# EAGLE schematic HPG_Solution (EAGLE 9.6.2)

## Sheet 1 of 2
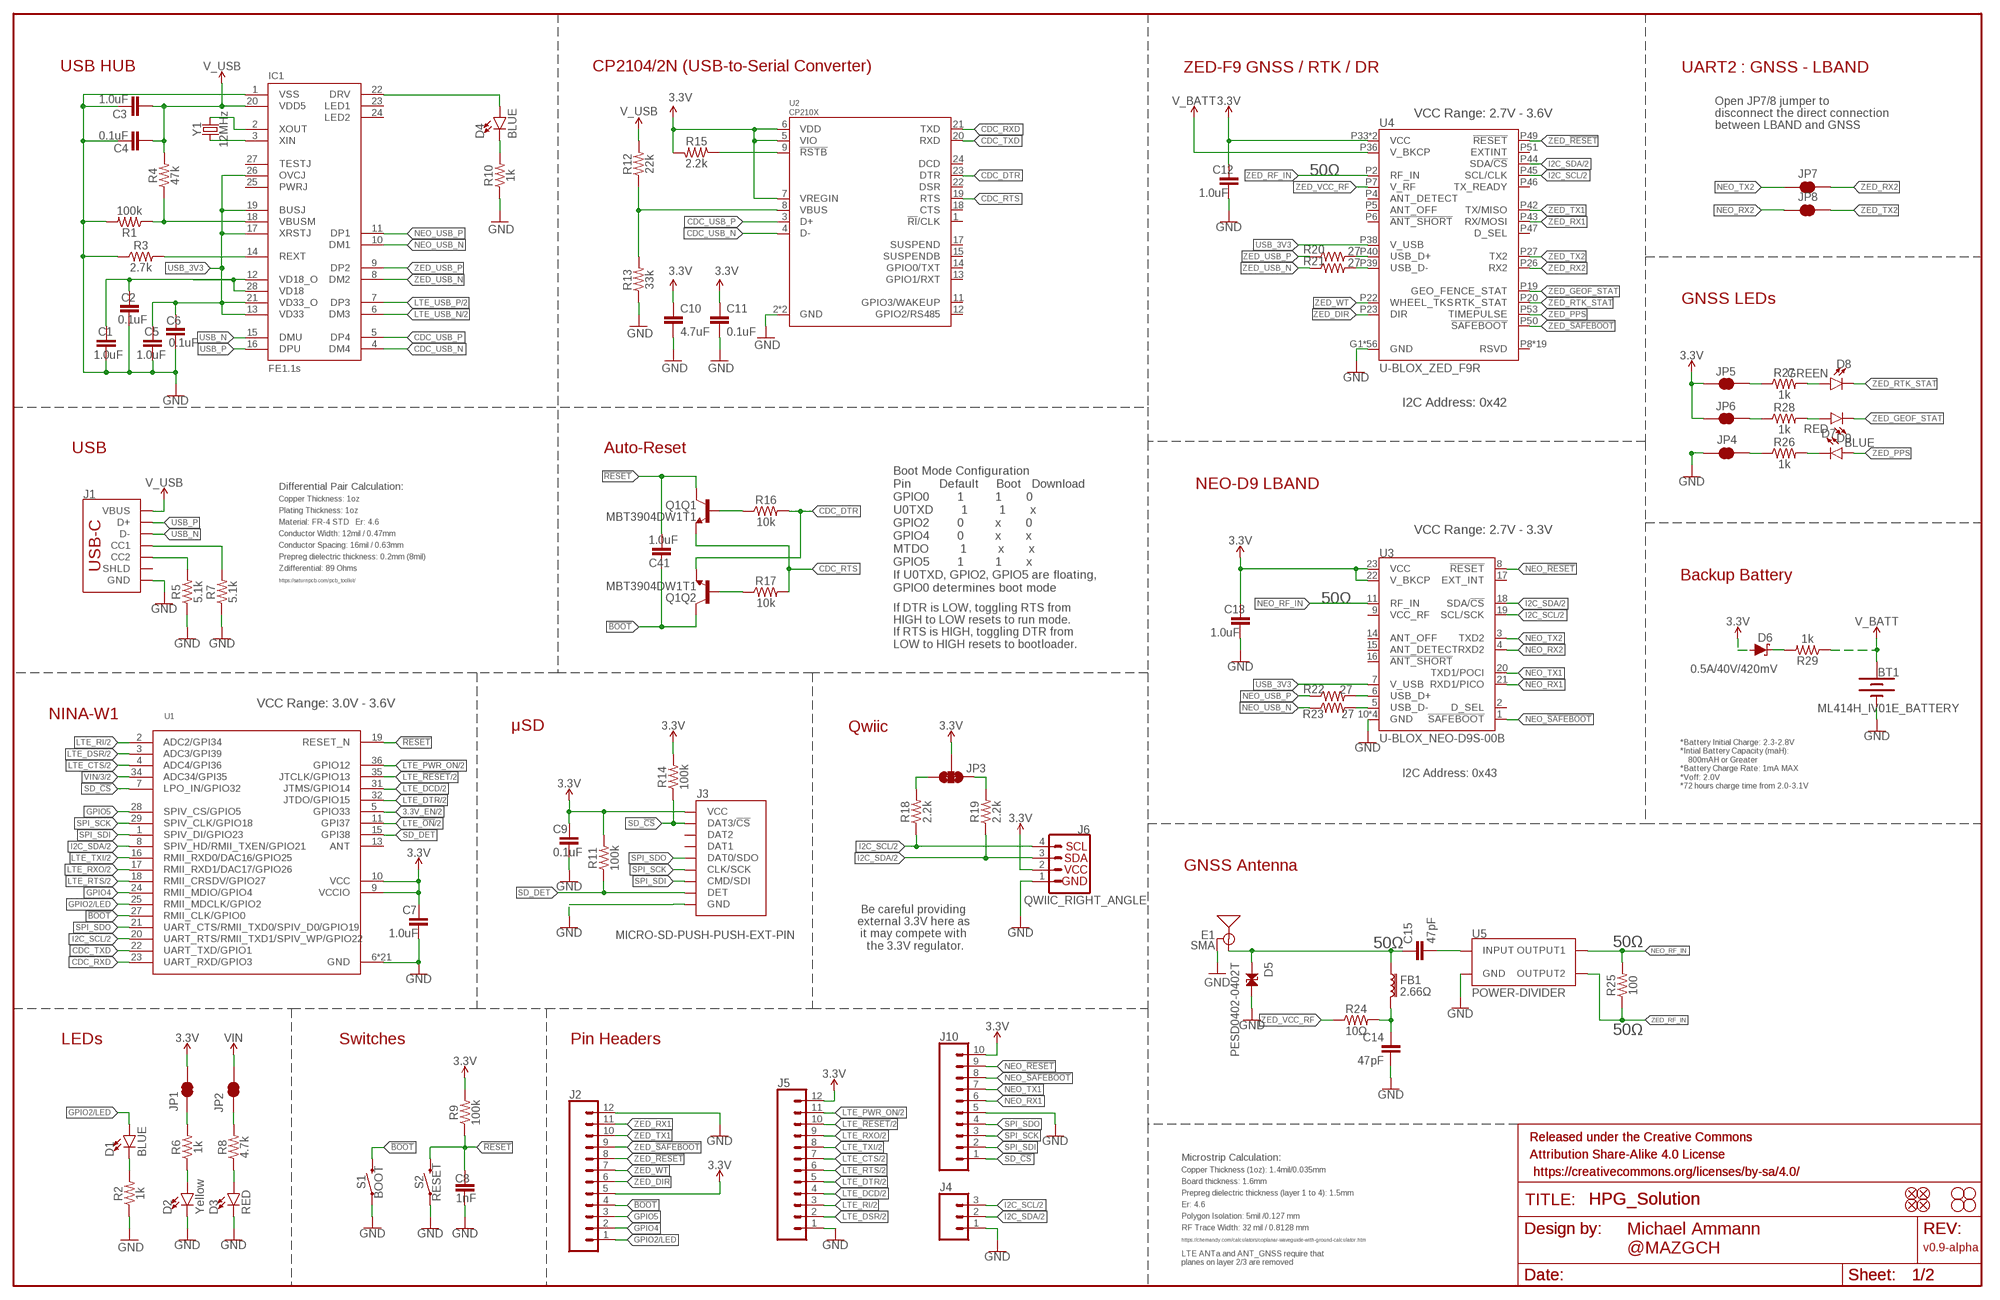
[diagram p0: schematic, sheet 1]

### Parts
BT1  ML414H_IV01E_BATTERY  [ML414H_IV01E]
C1  1.0uF  1.0UF-0603-16V-10%  [0603]
C2  0.1uF  0.1UF-0603-25V-5%  [0603]
C3  1.0uF  1.0UF-0603-16V-10%  [0603]
C4  0.1uF  0.1UF-0603-25V-5%  [0603]
C5  1.0uF  1.0UF-0603-16V-10%  [0603]
C6  0.1uF  0.1UF-0603-25V-5%  [0603]
C7  1.0uF  1.0UF-0603-16V-10%  [0603]
C8  1nF  1.0NF/1000PF-0603-50V-10%  [0603]
C9  0.1uF  0.1UF-0603-25V-5%  [0603]
C10  4.7uF  4.7UF0603  [0603]
C11  0.1uF  0.1UF-0603-25V-5%  [0603]
C12  1.0uF  1.0UF-0603-16V-10%  [0603]
C13  1.0uF  1.0UF-0603-16V-10%  [0603]
C14  47pF  47PF-0603-50V-5%  [0603]
C15  47pF  47PF-0603-50V-5%  [0603]
C41  1.0uF  1.0UF-0603-16V-10%  [0603]
D1  BLUE  LED-BLUE0603  [LED-0603]
D2  Yellow  LED-YELLOW0603  [LED-0603]
D3  RED  LED-RED0603  [LED-0603]
D4  BLUE  LED-BLUE0603  [LED-0603]
D5  PESD0402-0402T  [0402-TIGHT]
D6  0.5A/40V/420mV  DIODE-SCHOTTKY-PMEG4005EJ  [SOD-323]
D7  BLUE  LED-BLUE0603  [LED-0603]
D8  GREEN  LED-GREEN0603  [LED-0603]
D9  RED  LED-RED0603  [LED-0603]
E1  SMA  ANTENNA-SMA-GROUNDEDEDGE_SMA  [SMA-EDGE]
FB1  2.66Ω  FERRITE_BEAD-0402-2.66Ω-1GHZ  [0402-TIGHT]
FD1  FIDUCIALUFIDUCIAL  [FIDUCIAL-MICRO]
FD2  FIDUCIALUFIDUCIAL  [FIDUCIAL-MICRO]
FD3  FIDUCIALUFIDUCIAL  [FIDUCIAL-MICRO]
FD4  FIDUCIALUFIDUCIAL  [FIDUCIAL-MICRO]
FRAME1  FRAME-LEDGER  [CREATIVE_COMMONS]
FRAME2  FRAME-LEDGER  [CREATIVE_COMMONS]
H1  STAND-OFFTIGHT  [STAND-OFF-TIGHT]
H2  STAND-OFFTIGHT  [STAND-OFF-TIGHT]
H3  STAND-OFFTIGHT  [STAND-OFF-TIGHT]
H4  STAND-OFFTIGHT  [STAND-OFF-TIGHT]
IC1  FE1.1S  [FE1.1S_SSOP-28]
J1  USB_C_4-LAYER_PADS  [USB-C-16P_4LAYER-PADS]
J2  CONN_12NO_SILK  [1X12_NO_SILK]
J3  MICRO-SD-PUSH-PUSH-EXT-PIN  [MICROSD-EXTERNALPIN]
J4  CONN_031X03_NO_SILK  [1X03_NO_SILK]
J5  CONN_12NO_SILK  [1X12_NO_SILK]
J6  QWIIC_RIGHT_ANGLE  QWIIC_CONNECTORJS-1MM  [JST04_1MM_RA]
J10  CONN_10NO_SILK_PTH_FEMALE  [1X10_NO_SILK]
JP1  JUMPER-SMT_2_NC_TRACE_SILK  [SMT-JUMPER_2_NC_TRACE_SILK]
JP2  JUMPER-SMT_2_NC_TRACE_SILK  [SMT-JUMPER_2_NC_TRACE_SILK]
JP3  JUMPER-SMT_3_2-NC_TRACE_SILK  [SMT-JUMPER_3_2-NC_TRACE_SILK]
JP4  JUMPER-SMT_2_NC_TRACE_SILK  [SMT-JUMPER_2_NC_TRACE_SILK]
JP5  JUMPER-SMT_2_NC_TRACE_SILK  [SMT-JUMPER_2_NC_TRACE_SILK]
JP6  JUMPER-SMT_2_NC_TRACE_SILK  [SMT-JUMPER_2_NC_TRACE_SILK]
JP7  JUMPER-SMT_2_NC_TRACE_SILK  [SMT-JUMPER_2_NC_TRACE_SILK]
JP8  JUMPER-SMT_2_NC_TRACE_SILK  [SMT-JUMPER_2_NC_TRACE_SILK]
Q1  MBT3904DW1T1  TRANS_NPN_DUAL-MBT3904DW1T1  [SC70-6]
R1  100k  100KOHM-0603-1/10W-1%  [0603]
R2  1k  1KOHM-0603-1/10W-1%  [0603]
R3  2.7k  2.7KOHM-0603-1/10W-1%  [0603]
R4  47k  47KOHM-0603-1/10W-1%  [0603]
R5  5.1k  5.1KOHM5.1KOHM-0603-1/10W-1%  [0603]
R6  1k  1KOHM-0603-1/10W-1%  [0603]
R7  5.1k  5.1KOHM5.1KOHM-0603-1/10W-1%  [0603]
R8  4.7k  4.7KOHM-0603-1/10W-1%  [0603]
R9  100k  100KOHM-0603-1/10W-1%  [0603]
R10  1k  1KOHM-0603-1/10W-1%  [0603]
R11  100k  100KOHM-0603-1/10W-1%  [0603]
R12  22k  22KOHM-0603-1/10W-1%  [0603]
R13  33k  33KOHM-0603-1/10W-1%  [0603]
R14  100k  100KOHM-0603-1/10W-1%  [0603]
R15  2.2k  2.2KOHM-0603-1/10W-1%  [0603]
R16  10k  10KOHM-0603-1/10W-1%  [0603]
R17  10k  10KOHM-0603-1/10W-1%  [0603]
R18  2.2k  2.2KOHM-0603-1/10W-1%  [0603]
R19  2.2k  2.2KOHM-0603-1/10W-1%  [0603]
R20  27  27OHM-0603-1/10W-1%  [0603]
R21  27  27OHM-0603-1/10W-1%  [0603]
R22  27  27OHM-0603-1/10W-1%  [0603]
R23  27  27OHM-0603-1/10W-1%  [0603]
R24  10Ω  10OHM-0402-1/16W-5%  [0402-TIGHT]
R25  100  100OHM-0603-1/10W-1%  [0603]
R26  1k  1KOHM-0603-1/10W-1%  [0603]
R27  1k  1KOHM-0603-1/10W-1%  [0603]
R28  1k  1KOHM-0603-1/10W-1%  [0603]
R29  1k  1KOHM-0603-1/10W-1%  [0603]
S1  BOOT  MOMENTARY-SWITCH-SPST-SMD-5.2-TALL-REDUNDANT  [TACTILE_SWITCH_SMD_5.2MM]
S2  RESET  MOMENTARY-SWITCH-SPST-SMD-5.2-TALL-REDUNDANT  [TACTILE_SWITCH_SMD_5.2MM]
U1  NINA-W106NINA-W106  [NINA-W106]
U2  CP210X  CP2102N  [QFN24]
U3  U-BLOX_NEO-D9S-00B  [NEO-M9N/M8T/M8U/D9S]
U4  U-BLOX_ZED_F9R  [UBLOX_ZED_F9R]
U5  POWER-DIVIDER  [PD0922J5050S2HF_ANA]
Y1  12MHz  CRYSTAL-12MHZ"  [CRYSTAL-SMD-5X3.2-4PAD]

### Nets
3.3V [supply]: C7.1 C9.1 C10.1 C11.1 C12.1 C13.1 D6.A J2.5 J3.4(VCC) J5.12 J6.2 J10.10 JP1.2 JP3.2 JP5.1 JP6.1 R9.2 R11.2 R14.2 R15.2 U1.9(VCCIO) U1.10(VCC) U2.5(VIO) U2.6(VDD) U2.7(VREGIN) U3.22(V_BKCP) U3.23(VCC) U4.P33(VCC) U4.P34(VCC) ; also sheet 2
3.3V_EN: U1.5(GPIO33) ; also sheet 2
!BOOT!: C41.1 J2.4 Q1.6(Q2:C) S1.3 S1.4 U1.27(RMII_CLK/GPIO0)
!RESET!: C8.1 C41.2 Q1.3(Q1:C) R9.1 S2.3 S2.4 U1.19(RESET_N)
CDC_DTR: Q1.1(Q2:E) R16.2 U2.23(DTR)
CDC_RTS: Q1.4(Q1:E) R17.2 U2.19(RTS)
CDC_RXD: U1.23(UART_RXD/GPIO3) U2.21(TXD)
CDC_TXD: U1.22(UART_TXD/GPIO1) U2.20(RXD)
CDC_USB_N [DiffPair]: IC1.4(DM4) U2.4(D-)
CDC_USB_P [DiffPair]: IC1.5(DP4) U2.3(D+)
GND: BT1.- C1.2 C2.2 C3.1 C4.1 C5.2 C6.2 C7.2 C8.2 C9.2 C10.2 C11.2 C12.2 C13.2 C14.2 D2.C D3.C D5.2 E1.GND@0(GND) E1.GND@1(GND) E1.GND@2(GND) E1.GND@3(GND) IC1.1(VSS) J1.GND J1.GND2(GND) J2.12 J3.6(GND) J3.10(GND) J3.11(GND) J3.12(GND) J3.13(GND) J4.1 J5.1 J6.1 J10.5 JP4.1 R1.2 R2.1 R3.1 R5.1 R7.1 R10.1 R13.1 S1.1 S1.2 S2.1 S2.2 U1.6(GND) U1.12(GND) U1.14(GND) U1.26(GND) U1.30(GND) U1.GND@1(GND) U1.GND@2(GND) U1.GND@3(GND) U1.GND@4(GND) U1.GND@5(GND) U1.GND@6(GND) U1.GND@7(GND) U1.GND@8(GND) U1.GND@9(GND) U1.GND@10(GND) U1.GND@11(GND) U1.GND@12(GND) U1.GND@13(GND) U1.GND@14(GND) U1.GND@15(GND) U1.GND@16(GND) U2.2(GND) U2.PAD(GND) U3.10(GND) U3.12(GND) U3.13(GND) U3.24(GND) U4.G1(GND) U4.G2(GND) U4.G3(GND) U4.G4(GND) U4.G5(GND) U4.G6(GND) U4.G7(GND) U4.G8(GND) U4.G9(GND) U4.G10(GND) U4.G11(GND) U4.G12(GND) U4.G13(GND) U4.G14(GND) U4.G15(GND) U4.G16(GND) U4.G17(GND) U4.G18(GND) U4.G19(GND) U4.G20(GND) U4.G21(GND) U4.G22(GND) U4.G23(GND) U4.G24(GND) U4.G25(GND) U4.G26(GND) U4.G27(GND) U4.G28(GND) U4.G29(GND) U4.G30(GND) U4.G31(GND) U4.G32(GND) U4.G33(GND) U4.G34(GND) U4.G35(GND) U4.G36(GND) U4.G37(GND) U4.G38(GND) U4.G39(GND) U4.G40(GND) U4.G41(GND) U4.G42(GND) U4.G43(GND) U4.G44(GND) U4.G45(GND) U4.G46(GND) U4.G47(GND) U4.G48(GND) U4.P1(GND) U4.P3(GND) U4.P12(GND) U4.P14(GND) U4.P32(GND) U4.P37(GND) U4.P41(GND) U4.P48(GND) U5.1(GND) U5.3(GND) U5.5(GND) ; also sheet 2
GPIO2/LED: D1.A J2.1 U1.25(RMII_MDCLK/GPIO2)
GPIO4: J2.2 U1.24(RMII_MDIO/GPIO4)
GPIO5: J2.3 U1.28(SPIV_CS/GPIO5)
I2C_SCL: J4.3 J6.4 R18.1 U1.20(UART_RTS/RMII_TXD1/SPIV_WP/GPIO22) U3.19(SCL/SCK) U4.P45(SCL/CLK) ; also sheet 2
I2C_SDA: J4.2 J6.3 R19.1 U1.8(SPIV_HD/RMII_TXEN/GPIO21) U3.18(SDA/!CS!) U4.P44(SDA/!CS!) ; also sheet 2
LED1: D4.A IC1.22(DRV)
LTE_!ON!: U1.11(GPI37) ; also sheet 2
LTE_!RESET!: J5.10 U1.35(JTCLK/GPIO13) ; also sheet 2
LTE_CTS: J5.7 U1.4(ADC4/GPI36) ; also sheet 2
LTE_DCD: J5.4 U1.31(JTMS/GPIO14) ; also sheet 2
LTE_DSR: J5.2 U1.3(ADC3/GPI39) ; also sheet 2
LTE_DTR: J5.5 U1.32(JTDO/GPIO15) ; also sheet 2
LTE_PWR_ON: J5.11 U1.36(GPIO12) ; also sheet 2
LTE_RI: J5.3 U1.2(ADC2/GPI34) ; also sheet 2
LTE_RTS: J5.6 U1.18(RMII_CRSDV/GPIO27) ; also sheet 2
LTE_RXO: J5.9 U1.17(RMII_RXD1/DAC17/GPIO26) ; also sheet 2
LTE_TXI: J5.8 U1.16(RMII_RXD0/DAC16/GPIO25) ; also sheet 2
LTE_USB_N [DiffPair]: IC1.6(DM3) ; also sheet 2
LTE_USB_P [DiffPair]: IC1.7(DP3) ; also sheet 2
N$1: JP2.1 R8.2
N$2: R22.2 U3.6(USB_D+)
N$3: R23.2 U3.5(USB_D-)
N$6: JP1.1 R6.2
N$7: D2.A R6.1
N$8: D3.A R8.1
N$9: JP3.3 R18.2
N$10: J1.A5(CC1) R7.2
N$11: J1.B5(CC2) R5.2
N$12: D8.A R27.2
N$13: JP3.1 R19.2
N$14: C15.2 U5.2(INPUT)
N$16: JP5.2 R27.1
N$17: JP4.2 R26.1
N$18: Q1.5(Q1:B) R16.1
N$19: Q1.2(Q2:B) R17.1
N$23: D1.C R2.2
N$24: D7.C R26.2
N$25: D9.A R28.2
N$29: C14.1 FB1.2 R24.2
N$30: JP6.2 R28.1
N$38: R12.1 R13.2 U2.8(VBUS)
N$39: D6.C R29.2
N$40: R21.2 U4.P39(USB_D-)
N$41: R15.1 U2.9(!RSTB)
N$42: R20.2 U4.P40(USB_D+)
N$43: C1.1 C2.1 IC1.12(VD18_O) IC1.28(VD18)
N$44: IC1.14(REXT) R3.2
N$45: IC1.2(XOUT) Y1.3
N$46: IC1.3(XIN) Y1.1
N$51: D4.C R10.2
N$57: IC1.18(VBUSM) R1.1 R4.1
NEO_!RESET!: J10.9 U3.8(!RESET!)
NEO_!SAFEBOOT!: J10.8 U3.1(!SAFEBOOT!)
NEO_RF_IN [RF]: R25.2 U3.11(RF_IN) U5.4(OUTPUT1)
NEO_RX1: J10.6 U3.21(RXD1/PICO)
NEO_RX2: JP8.1 U3.4(RXD2)
NEO_TX1: J10.7 U3.20(TXD1/POCI)
NEO_TX2: JP7.1 U3.3(TXD2)
NEO_USB_N [DiffPair]: IC1.10(DM1) R23.1
NEO_USB_P [DiffPair]: IC1.11(DP1) R22.1
RF_IN [RF]: C15.1 D5.1 E1.SIG(SIGNAL) FB1.1
SD_!CS!: J3.2(DAT3/!CS!) J10.1 R14.1 U1.7(LPO_IN/GPIO32)
SD_DET: J3.9(DET) R11.1 U1.15(GPI38)
SPI_SCK: J3.5(CLK/SCK) J10.3 U1.29(SPIV_CLK/GPIO18)
SPI_SDI: J3.3(CMD/SDI) J10.2 U1.1(SPIV_DI/GPIO23)
SPI_SDO: J3.7(DAT0/SDO) J10.4 U1.21(UART_CTS/RMII_TXD0/SPIV_D0/GPIO19)
USB_3V3 [supply]: C5.1 C6.1 IC1.13(VD33) IC1.17(XRSTJ) IC1.19(BUSJ) IC1.21(VD33_O) IC1.26(OVCJ) U3.7(V_USB) U4.P38(V_USB)
USB_N [DiffPair]: IC1.15(DMU) J1.A7(D-) J1.B7(D-)
USB_P [DiffPair]: IC1.16(DPU) J1.A6(D+) J1.B6(D+)
V_BATT [supply]: BT1.+ R29.1 U4.P36(V_BKCP)
V_USB [power]: C3.2 C4.2 IC1.20(VDD5) J1.VBUS1(VBUS) J1.VBUS2(VBUS) R4.2 R12.2 ; also sheet 2
VIN [power]: JP2.2 ; also sheet 2
VIN/3: U1.34(ADC34/GPI35) ; also sheet 2
ZED_!RESET!: J2.8 U4.P49(!RESET!)
ZED_!SAFEBOOT!: J2.9 U4.P50(!SAFEBOOT!)
ZED_DIR: J2.6 U4.P23(DIR)
ZED_GEOF_STAT: D9.C U4.P19(GEO_FENCE_STAT)
ZED_PPS: D7.A U4.P53(TIMEPULSE)
ZED_RF_IN [RF]: R25.1 U4.P2(RF_IN) U5.6(OUTPUT2)
ZED_RTK_STAT: D8.C U4.P20(RTK_STAT)
ZED_RX1: J2.11 U4.P43(RX/MOSI)
ZED_RX2: JP7.2 U4.P26(RX2)
ZED_TX1: J2.10 U4.P42(TX/MISO)
ZED_TX2: JP8.2 U4.P27(TX2)
ZED_USB_N [DiffPair]: IC1.8(DM2) R21.1
ZED_USB_P [DiffPair]: IC1.9(DP2) R20.1
ZED_VCC_RF [supply]: R24.1 U4.P7(V_RF)
ZED_WT: J2.7 U4.P22(WHEEL_TKS)
Unconnected: IC1.23(LED1) IC1.24(LED2) IC1.25(PWRJ) IC1.27(TESTJ) J1.SHLD1(SHLD) J1.SHLD2(SHLD) J1.SHLD3(SHLD) J1.SHLD4(SHLD) J3.1(DAT2) J3.8(DAT1) U1.13(ANT) U2.1(!RI!/CLK) U2.11(GPIO3/WAKEUP) U2.12(GPIO2/RS485) U2.13(GPIO1/RXT) U2.14(GPIO0/TXT) U2.15(SUSPENDB) U2.17(SUSPEND) U2.18(CTS) U2.22(DSR) U2.24(DCD) U3.2(D_SEL) U3.9(VCC_RF) U3.14(ANT_OFF) U3.15(ANT_DETECT) U3.16(!ANT_SHORT!) U3.17(EXT_INT) U4.P4(ANT_DETECT) U4.P5(ANT_OFF) U4.P6(!ANT_SHORT!) U4.P8(RSVD) U4.P9(RSVD) U4.P10(RSVD) U4.P11(RSVD) U4.P13(RSVD) U4.P15(RSVD) U4.P16(RSVD) U4.P17(RSVD) U4.P18(RSVD) U4.P21(RSVD) U4.P24(RSVD) U4.P25(RSVD) U4.P28(RSVD) U4.P29(RSVD) U4.P30(RSVD) U4.P31(RSVD) U4.P35(RSVD) U4.P46(TX_READY) U4.P47(D_SEL) U4.P51(EXTINT) U4.P52(RSVD) U4.P54(RSVD)

### Notes on the sheet
- USB HUB | CP2104/2N (USB-to-Serial Converter) | ZED-F9 GNSS / RTK / DR | UART2 : GNSS - LBAND
- VCC Range: 2.7V - 3.6V
- Open JP7/8 jumper to 
  disconnect the direct connection 
  between LBAND and GNSS
- 50Ω
- GNSS LEDs
- I2C Address: 0x42
- USB | Auto-Reset
- Differential Pair Calculation: | NEO-D9 LBAND
- Copper Thickness: 1oz
- Plating Thickness: 1oz
- Material: FR-4 STD   Er: 4.6
- Conductor Width: 12mil / 0.47mm | VCC Range: 2.7V - 3.3V
- Conductor Spacing: 16mil / 0.63mm
- Prepreg dielectric thickness: 0.2mm (8mil)
- Zdifferential: 89 Ohms
- Backup Battery
- https://saturnpcb.com/pcb_toolkit/
- Boot Mode Configuration
  Pin        Default     Boot   Download
  GPIO0        1         1       0
  U0TXD        1         1       x
  GPIO2        0         x       0
  GPIO4        0         x       x
  MTDO         1         x       x
  GPIO5        1         1       x
  If U0TXD, GPIO2, GPIO5 are floating, 
  GPIO0 determines boot mode
- If DTR is LOW, toggling RTS from 
  HIGH to LOW resets to run mode.
  If RTS is HIGH, toggling DTR from 
  LOW to HIGH resets to bootloader.
- 50Ω
- VCC Range: 3.0V - 3.6V
- NINA-W1
- μSD | Qwiic
- I2C Address: 0x43
- *Battery Initial Charge: 2.3-2.8V
  *Intial Battery Capacity (maH): 
      800mAH or Greater
  *Battery Charge Rate: 1mA MAX
  *Voff: 2.0V
  *72 hours charge time from 2.0-3.1V
- GNSS Antenna
- Be careful providing 
  external 3.3V here as 
  it may compete with 
  the 3.3V regulator.
- 50Ω | 50Ω
- 50Ω
- LEDs | Switches | Pin Headers
- Microstrip Calculation:
- Copper Thickness (1oz): 1.4mil/0.035mm
- Board thickness: 1.6mm
- Prepreg dielectric thickness (layer 1 to 4): 1.5mm
- Er: 4.6
- Polygon Isolation: 5mil /0.127 mm
- RF Trace Width: 32 mil / 0.8128 mm
- https://chemandy.com/calculators/coplanar-waveguide-with-ground-calculator.htm
- v0.9-alpha
- Michael Ammann 
  @MAZGCH
- LTE ANTa and ANT_GNSS require that 
  planes on layer 2/3 are removed

## Sheet 2 of 2
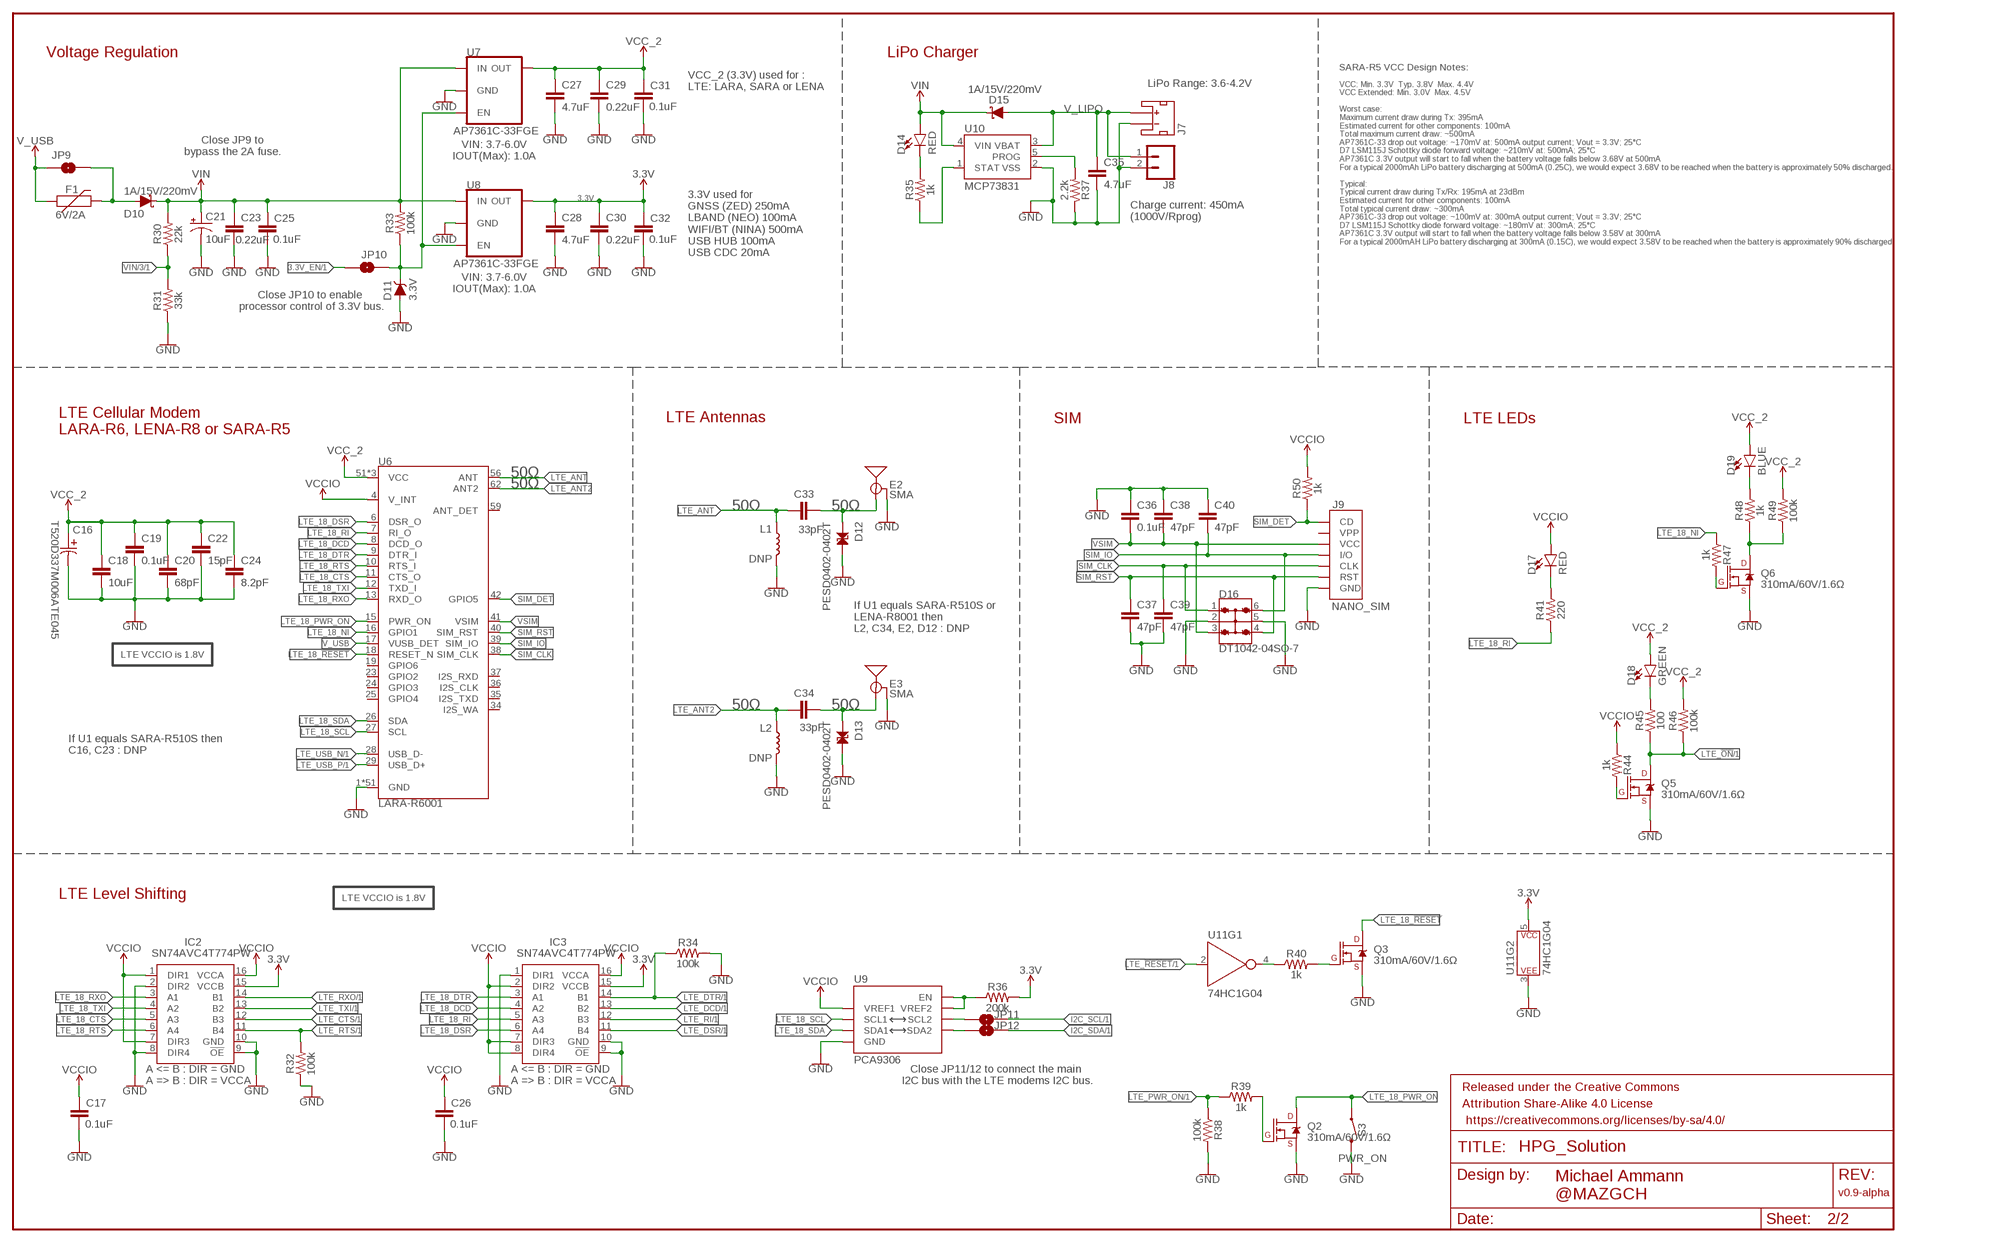
[diagram p1: schematic, sheet 2]

### Parts
C16  T520D337M006ATE045  [CAPMP7.6X4.3_3.1N_KEM]
C17  0.1uF  0.1UF-0603-25V-5%  [0603]
C18  10uF  10UF-0603-6.3V-20%  [0603]
C19  0.1uF  0.1UF-0603-25V-5%  [0603]
C20  68pF  68PF-0603-50V-5%  [0603@1]
C21  10uF  10UF-POLAR-EIA3216-16V-10%(TANT)  [EIA3216]
C22  15pF  15PF-0603-50V-5%  [0603]
C23  0.22uF  0.22UF-0603-25V-10%  [0603]
C24  8.2pF  8.2PF-0603-50V-10%  [0603]
C25  0.1uF  0.1UF-0603-25V-5%  [0603]
C26  0.1uF  0.1UF-0603-25V-5%  [0603]
C27  4.7uF  4.7UF0603  [0603]
C28  4.7uF  4.7UF0603  [0603]
C29  0.22uF  0.22UF-0603-25V-10%  [0603]
C30  0.22uF  0.22UF-0603-25V-10%  [0603]
C31  0.1uF  0.1UF-0603-25V-5%  [0603]
C32  0.1uF  0.1UF-0603-25V-5%  [0603]
C33  33pF  33PF-0402-25V-5%-X7R  [0402]
C34  33pF  33PF-0402-25V-5%-X7R  [0402]
C35  4.7uF  4.7UF0603  [0603]
C36  0.1uF  0.1UF-0603-25V-5%  [0603]
C37  47pF  47PF-0603-50V-5%  [0603]
C38  47pF  47PF-0603-50V-5%  [0603]
C39  47pF  47PF-0603-50V-5%  [0603]
C40  47pF  47PF-0603-50V-5%  [0603]
D10  1A/15V/220mV  DIODE-SCHOTTKY-LSM115JE3  [DO-214BA]
D11  3.3V  DIODE-ZENER-MM3Z3V3T1G  [SOD-323]
D12  PESD0402-0402T  [0402-TIGHT]
D13  PESD0402-0402T  [0402-TIGHT]
D14  RED  LED-RED0603  [LED-0603]
D15  1A/15V/220mV  DIODE-SCHOTTKY-LSM115JE3  [DO-214BA]
D16  DT1042-04SO-7  TVS_DIODE_ARRAY_4DT1042-04SO-7  [SOT23-6L]
D17  RED  LED-RED0603  [LED-0603]
D18  GREEN  LED-GREEN0603  [LED-0603]
D19  BLUE  LED-BLUE0603  [LED-0603]
E2  SMA  ANTENNA-SMA-GROUNDEDEDGE_SMA  [SMA-EDGE]
E3  SMA  ANTENNA-SMA-GROUNDEDEDGE_SMA  [SMA-EDGE]
F1  6V/2A  PPTC_6V2A  [1210]
FRAME3  FRAME-LEDGER  [CREATIVE_COMMONS]
IC2  SN74AVC4T774PW  [SOP65P640X120-16N]
IC3  SN74AVC4T774PW  [SOP65P640X120-16N]
J7  JST_2MM_MALE  [JST-2-SMD]
J8  CONN_021X02_NO_SILK  [1X02_NO_SILK]
J9  NANO_SIM  SIMHOLDER-PUSHPUSH  [NANO_SIM_PP]
JP9  JUMPER-SMT_2_NO_SILK  [SMT-JUMPER_2_NO_SILK]
JP10  JUMPER-SMT_2_NO_SILK  [SMT-JUMPER_2_NO_SILK]
JP11  JUMPER-SMT_2_NO_SILK  [SMT-JUMPER_2_NO_SILK]
JP12  JUMPER-SMT_2_NO_SILK  [SMT-JUMPER_2_NO_SILK]
L1  DNP  INDUCTOR_DNP-0402  [0402_COILCRAFT]
L2  DNP  INDUCTOR_DNP-0402  [0402_COILCRAFT]
Q2  310mA/60V/1.6Ω  MOSFET-NCH-2N7002PW  [SOT323]
Q3  310mA/60V/1.6Ω  MOSFET-NCH-2N7002PW  [SOT323]
Q5  310mA/60V/1.6Ω  MOSFET-NCH-2N7002PW  [SOT323]
Q6  310mA/60V/1.6Ω  MOSFET-NCH-2N7002PW  [SOT323]
R30  22k  22KOHM-0603-1/10W-1%  [0603]
R31  33k  33KOHM-0603-1/10W-1%  [0603]
R32  100k  100KOHM-0603-1/10W-1%  [0603]
R33  100k  100KOHM-0603-1/10W-1%  [0603]
R34  100k  100KOHM-0603-1/10W-1%  [0603]
R35  1k  1KOHM-0603-1/10W-1%  [0603]
R36  200k  200KOHM-0603-1/10W-1%  [0603]
R37  2.2k  2.2KOHM-0603-1/10W-1%  [0603]
R38  100k  100KOHM-0603-1/10W-1%  [0603]
R39  1k  1KOHM-0603-1/10W-1%  [0603]
R40  1k  1KOHM-0603-1/10W-1%  [0603]
R41  220  220OHM-0603-1/10W-1%  [0603]
R44  1k  1KOHM-0603-1/10W-1%  [0603]
R45  100  100OHM-0603-1/10W-1%  [0603]
R46  100k  100KOHM-0603-1/10W-1%  [0603]
R47  1k  1KOHM-0603-1/10W-1%  [0603]
R48  1k  1KOHM-0603-1/10W-1%  [0603]
R49  100k  100KOHM-0603-1/10W-1%  [0603]
R50  1k  1KOHM-0603-1/10W-1%  [0603]
S3  PWR_ON  MOMENTARY-SWITCH-SPST-SMD-5.2-TALL-REDUNDANT  [TACTILE_SWITCH_SMD_5.2MM]
U6  LARA-R6001  [LARA-LGA]
U7  AP7361C-33FGE  AP7361C-33FGEUDFN-8  [UDFN-8]
U8  AP7361C-33FGE  AP7361C-33FGEUDFN-8  [UDFN-8]
U9  PCA9306  PCA9306VSSOP_8PIN  [VSSOP_8PIN]
U10  MCP73831  [SOT23-5]
U11  74HC1G04  [SOT353]

### Nets
3.3V [supply]: C28.1 C30.1 C32.1 IC2.15(VCCB) IC3.15(VCCB) R36.2 U8.1(OUT) U11.5(P$V+) ; also sheet 1
3.3V_EN: JP10.1 ; also sheet 1
CHG_LED: R35.1 U10.1(STAT)
GND: C16.2 C17.2 C18.2 C19.2 C20.2 C21.- C22.2 C23.2 C24.2 C25.2 C26.2 C27.2 C28.2 C29.2 C30.2 C31.2 C32.2 C35.2 C36.1 C37.2 C38.1 C39.2 C40.1 D11.A D12.2 D13.2 D16.2 D16.5 E2.GND@0(GND) E2.GND@1(GND) E2.GND@2(GND) E2.GND@3(GND) E3.GND@0(GND) E3.GND@1(GND) E3.GND@2(GND) E3.GND@3(GND) IC2.2(DIR2) IC2.8(DIR4) IC2.9(!OE) IC2.10(GND) IC3.1(DIR1) IC3.9(!OE) IC3.10(GND) J7.1(-) J8.2 J9.C5(GND) L1.P$2 L2.P$2 Q2.2(S) Q3.2(S) Q5.2(S) Q6.2(S) R31.1 R32.1 R34.2 R37.1 R38.2 S3.3 S3.4 U6.1(GND) U6.3(GND) U6.5(GND) U6.14(GND) U6.20(GND) U6.21(GND) U6.22(GND) U6.30(GND) U6.32(GND) U6.43(GND) U6.50(GND) U6.54(GND) U6.55(GND) U6.57(GND) U6.58(GND) U6.60(GND) U6.61(GND) U6.63(GND) U6.64(GND) U6.65(GND) U6.66(GND) U6.67(GND) U6.68(GND) U6.69(GND) U6.70(GND) U6.71(GND) U6.72(GND) U6.73(GND) U6.74(GND) U6.75(GND) U6.76(GND) U6.77(GND) U6.78(GND) U6.79(GND) U6.80(GND) U6.81(GND) U6.82(GND) U6.83(GND) U6.84(GND) U6.85(GND) U6.86(GND) U6.87(GND) U6.88(GND) U6.89(GND) U6.90(GND) U6.91(GND) U6.92(GND) U6.93(GND) U6.94(GND) U6.95(GND) U6.96(GND) U7.4(GND) U7.EP(GND) U8.4(GND) U8.EP(GND) U9.P1(GND) U10.2(VSS) U11.3(P$V-) ; also sheet 1
I2C_SCL: JP11.2 ; also sheet 1
I2C_SDA: JP12.2 ; also sheet 1
LTE_18_!RESET!: Q3.3(D) U6.18(RESET_N)
LTE_18_CTS: IC2.5(A3) U6.11(CTS_O)
LTE_18_DCD: IC3.4(A2) U6.8(DCD_O)
LTE_18_DSR: IC3.6(A4) U6.6(DSR_O)
LTE_18_DTR: IC3.3(A1) U6.9(DTR_I)
LTE_18_NI: R47.1 U6.16(GPIO1)
LTE_18_PWR_ON: Q2.3(D) S3.1 S3.2 U6.15(PWR_ON)
LTE_18_RI: IC3.5(A3) R41.1 U6.7(RI_O)
LTE_18_RTS: IC2.6(A4) U6.10(RTS_I)
LTE_18_RXO: IC2.3(A1) U6.13(RXD_O)
LTE_18_SCL: U6.27(SCL) U9.P3(SCL1)
LTE_18_SDA: U6.26(SDA) U9.P4(SDA1)
LTE_18_TXI: IC2.4(A2) U6.12(TXD_I)
LTE_!ON!: Q5.3(D) R45.1 R46.1 ; also sheet 1
LTE_!RESET!: U11.2(A) ; also sheet 1
LTE_ANT [RF]: C33.1 L1.P$1 U6.56(ANT)
LTE_ANT2 [RF]: C34.1 L2.P$1 U6.62(ANT2)
LTE_CTS: IC2.12(B3) ; also sheet 1
LTE_DCD: IC3.13(B2) ; also sheet 1
LTE_DSR: IC3.11(B4) ; also sheet 1
LTE_DTR: IC3.14(B1) R34.1 ; also sheet 1
LTE_PWR_ON: R38.1 R39.1 ; also sheet 1
LTE_RI: IC3.12(B3) ; also sheet 1
LTE_RTS: IC2.11(B4) R32.2 ; also sheet 1
LTE_RXO: IC2.14(B1) ; also sheet 1
LTE_SCL: JP11.1 U9.P6(SCL2)
LTE_SDA: JP12.1 U9.P5(SDA2)
LTE_TXI: IC2.13(B2) ; also sheet 1
LTE_USB_N [DiffPair]: U6.28(USB_D-) ; also sheet 1
LTE_USB_P [DiffPair]: U6.29(USB_D+) ; also sheet 1
N$4 [RF]: C34.2 D13.1 E3.SIG(SIGNAL)
N$5 [power]: D10.A F1.2 JP9.2
N$15 [RF]: C33.2 D12.1 E2.SIG(SIGNAL)
N$20: R37.2 U10.5(PROG)
N$21: D14.C R35.2
N$22: R36.1 U9.P7(VREF2) U9.P8(EN)
N$26: Q2.1(G) R39.2
N$27: Q3.1(G) R40.2
N$28: R40.1 U11.4(Y)
N$34: D17.C R41.2
N$35: Q6.1(G) R47.2
N$36: Q6.3(D) R48.1 R49.1
N$37: D19.C R48.2
N$47: Q5.1(G) R44.2
N$49: D18.C R45.2
N$50: D11.C JP10.2 R33.1 U7.5(EN) U8.5(EN)
SIM_CLK: C39.1 D16.1 J9.C3(CLK) U6.38(SIM_CLK)
SIM_DET: J9.CD R50.1 U6.42(GPIO5)
SIM_IO: C40.2 D16.6 J9.C7(I/O) U6.39(SIM_IO)
SIM_RST: C37.1 D16.4 J9.C2(RST) U6.40(SIM_RST)
V_LIPO [power]: C35.1 D15.A J7.2(+) J8.1 U10.3(VBAT)
V_USB [power]: F1.1 JP9.1 U6.17(VUSB_DET) ; also sheet 1
VCC_2 [supply]: C16.1 C18.1 C19.1 C20.1 C22.1 C24.1 C27.1 C29.1 C31.1 D18.A D19.A R46.2 R49.2 U6.51(VCC) U6.52(VCC) U6.53(VCC) U7.1(OUT)
VCCIO [supply]: C17.1 C26.1 D17.A IC2.1(DIR1) IC2.7(DIR3) IC2.16(VCCA) IC3.2(DIR2) IC3.7(DIR3) IC3.8(DIR4) IC3.16(VCCA) R44.1 R50.2 U6.4(V_INT) U9.P2(VREF1)
VIN [power]: C21.+ C23.1 C25.1 D10.C D14.A D15.C R30.2 R33.2 U7.8(IN) U8.8(IN) U10.4(VIN) ; also sheet 1
VIN/3: R30.1 R31.2 ; also sheet 1
VSIM [supply]: C36.2 C38.2 D16.3 J9.C1(VCC) U6.41(VSIM)
Unconnected: J7.NC1(PAD1) J7.NC2(PAD2) J9.C6(VPP) U6.19(GPIO6) U6.23(GPIO2) U6.24(GPIO3) U6.25(GPIO4) U6.34(I2S_WA) U6.35(I2S_TXD) U6.36(I2S_CLK) U6.37(I2S_RXD) U6.59(ANT_DET)

### Notes on the sheet
- Voltage Regulation | LiPo Charger
- SARA-R5 VCC Design Notes:
- LiPo Range: 3.6-4.2V
- VCC: Min. 3.3V  Typ. 3.8V  Max. 4.4V
  VCC Extended: Min. 3.0V  Max. 4.5V
  
  Worst case:
  Maximum current draw during Tx: 395mA
  Estimated current for other components: 100mA
  Total maximum current draw: ~500mA
  AP7361C-33 drop out voltage: ~170mV at: 500mA output current; Vout = 3.3V; 25°C
  D7 LSM115J Schottky diode forward voltage: ~210mV at: 500mA; 25°C
  AP7361C 3.3V output will start to fall when the battery voltage falls below 3.68V at 500mA
  For a typical 2000mAh LiPo battery discharging at 500mA (0.25C), we would expect 3.68V to be reached when the battery is approximately 50% discharged.
  
  Typical:
  Typical current draw during Tx/Rx: 195mA at 23dBm
  Estimated current for other components: 100mA
  Total typical current draw: ~300mA
  AP7361C-33 drop out voltage: ~100mV at: 300mA output current; Vout = 3.3V; 25°C
  D7 LSM115J Schottky diode forward voltage: ~180mV at: 300mA; 25°C
  AP7361C 3.3V output will start to fall when the battery voltage falls below 3.58V at 300mA
  For a typical 2000mAH LiPo battery discharging at 300mA (0.15C), we would expect 3.58V to be reached when the battery is approximately 90% discharged.
- VCC_2 (3.3V) used for :
  LTE: LARA, SARA or LENA
- Close JP9 to 
  bypass the 2A fuse.
- VIN: 3.7-6.0V
  IOUT(Max): 1.0A
- Charge current: 450mA
  (1000V/Rprog)
- 3.3V used for 
  GNSS (ZED) 250mA
  LBAND (NEO) 100mA
  WIFI/BT (NINA) 500mA
  USB HUB 100mA
  USB CDC 20mA
- VIN: 3.7-6.0V
  IOUT(Max): 1.0A
- Close JP10 to enable 
  processor control of 3.3V bus.
- LTE Antennas | SIM | LTE LEDs
- LTE Cellular Modem 
  LARA-R6, LENA-R8 or SARA-R5
- 50Ω
- 50Ω
- 50Ω | 50Ω
- If U1 equals SARA-R510S or 
  LENA-R8001 then 
  L2, C34, E2, D12 : DNP
- LTE VCCIO is 1.8V
- 50Ω | 50Ω
- If U1 equals SARA-R510S then
  C16, C23 : DNP
- LTE VCCIO is 1.8V
- LTE Level Shifting
- Close JP11/12 to connect the main 
  I2C bus with the LTE modems I2C bus.
- v0.9-alpha
- Michael Ammann 
  @MAZGCH

## Library data of the parts
BT1 = SparkFun-Batteries:ML414H_IV01E_BATTERY: SEIKO ML414H-IV01E Reflowable Lithium Battery ML414H is a rechargeable, coin type battery with features such as Pb-free reflowable (Peak temperature: 260 C) and high temperature heat resistance. Battery Characteristics: 3.1V max voltage Voff is 2V 1mAH 3k series resistor with battery 72 hour charge time from 2.0-3.1V 2.3-2.8V initial charge; PROD_ID: BATT-14267
C1 C3 C5 C7 C12 C13 C41 = SparkFun-Capacitors:1.0UF: 1µF ceramic capacitors A capacitor is a passive two-terminal electrical component used to store electrical energy temporarily in an electric field.; PROD_ID: CAP-00868
C2 C4 C6 C9 C11 C17 C19 C25 C26 C31 C32 C36 = SparkFun-Capacitors:0.1UF: 0.1µF ceramic capacitors A capacitor is a passive two-terminal electrical component used to store electrical energy temporarily in an electric field.; PROD_ID: CAP-08604
C8 = SparkFun-Capacitors:1.0NF/1000PF: 1nF/1,000pF ceramic capacitors A capacitor is a passive two-terminal electrical component used to store electrical energy temporarily in an electric field.; PROD_ID: CAP-07886
C10 C27 C28 C35 = SparkFun-Capacitors:4.7UF: 4.7µF ceramic capacitors A capacitor is a passive two-terminal electrical component used to store electrical energy temporarily in an electric field.; PROD_ID: CAP-08280
C14 C15 C37-C40 = SparkFun-Capacitors:47PF: 47pF ceramic capacitors A capacitor is a passive two-terminal electrical component used to store electrical energy temporarily in an electric field.; PROD_ID: CAP-08913
C16 = untitled:T520D337M006ATE045; COPYRIGHT: Copyright (C) 2022 Ultra Librarian. All rights reserved.; DIGI-KEY_PART_NUMBER_1: 399-4055-1-ND; DIGI-KEY_PART_NUMBER_2: 399-4055-2-ND; DIGI-KEY_PART_NUMBER_3: 399-4055-6-ND; MANUFACTURER_PART_NUMBER: T520D337M006ATE045; MFR_NAME: Kemet; PROD_ID: CAP-16660
C18 = SparkFun-Capacitors:10UF: 10.0µF ceramic capacitors A capacitor is a passive two-terminal electrical component used to store electrical energy temporarily in an electric field.; PROD_ID: CAP-11015
C20 = SparkFun-Capacitors:68PF: 68pF ceramic capacitors A capacitor is a passive two-terminal electrical component used to store electrical energy temporarily in an electric field.; PROD_ID: CAP-14092
C21 = SparkFun-Capacitors:10UF-POLAR: 10.0µF polarized capacitors A capacitor is a passive two-terminal electrical component used to store electrical energy temporarily in an electric field.; PROD_ID: CAP-00811
C22 = SparkFun-Capacitors:15PF: 15pF ceramic capacitors A capacitor is a passive two-terminal electrical component used to store electrical energy temporarily in an electric field.; PROD_ID: CAP-07881
C23 C29 C30 = SparkFun-Capacitors:0.22UF: 0.22µF ceramic capacitors A capacitor is a passive two-terminal electrical component used to store electrical energy temporarily in an electric field.; PROD_ID: CAP-07822
C24 = HPG_Solution:8.2PF: 8.2pF ceramic capacitors A capacitor is a passive two-terminal electrical component used to store electrical energy temporarily in an electric field.
C33 C34 = New_Parts:33PF: 33pF ceramic capacitors A capacitor is a passive two-terminal electrical component used to store electrical energy temporarily in an electric field.; DIGIKEY_PART: 490-5936-1-ND; MANUFACTURER: Murata; MANU_PART: GRM1555C1H330JA; PROD_ID: CAP-15358
D1 D4 D7 D19 = SparkFun-LED:LED-BLUE: Blue SMD LED Used in manufacturing of various products at SparkFun Packages: 0603 - SMD 0603 package [Product Link] <http://www.digikey.com/product-detail/en/SMLE12BC7TT86/511-1589-2-ND/1641808> 1206 - SMD1206 package [Product Link] <http://www.digikey.com/product-detail/en/lite-on-inc/LTST-C150TBKT/160-1643-1-ND/573584> SparkFun Products: ESP8266 Thing-Dev Board <https://www.sparkfun.com/products/13711> RedBoard <https://www.sparkfun.com/products/12757>; PROD_ID: DIO-08575
D2 = SparkFun-LED:LED-YELLOW: Yellow SMD LED Used in manufacturing several products at SparkFun. Packages: 0603 - SMD 0603 package[Product Link] <http://www.kingbrightusa.com/product.asp?catalog_name=LED&product_id=APT1608SYCK> 0603 -SMART - SMART SMD 0603 package (more efficient/more expensive) [Product Link] <http://www.osram-os.com/osram_os/en/products/product-catalog/led-light-emitting-diodes/smartled-0603/ly-l29k/index.jsp> LilyPad - SMD1206 package[Product Datasheet] <https://www.sparkfun.com/datasheets/DevTools/LilyPad/Q150YUS4.pdf> SparkFun Products: Blynk Board <https://www.sparkfun.com/products/13794> IOIO-OTG <https://www.sparkfun.com/products/13613> XBee Explorer Serial <https://www.sparkfun.com/products/13225>; PROD_ID: DIO-09003
D3 D9 D14 D17 = SparkFun-LED:LED-RED: Red SMD LED Used in manufacturing of most products at SparkFun Packages: 0603 - SMD 0603 package [Product Link] <http://docs.avagotech.com/docs/AV02-0551EN> 0603 SMART - SMD 0603 SMART package ( more efficient and expensive)[Product Link] <http://www.osram-os.com/Graphics/XPic2/00077099_0.pdf> 1206 - SMD1206 package [Product Link] <https://www.sparkfun.com/datasheets/DevTools/LilyPad/Q150OVS4.pdff> SparkFun Products: Pro Mini 328 -5V <https://www.sparkfun.com/products/821> RedBoard <https://www.sparkfun.com/products/12757> IOIO-OTG <https://www.sparkfun.com/products/13613>; PROD_ID: DIO-00819
D5 D12 D13 = SparkFun-DiscreteSemi:PESD0402: ESD protection diode PESD is used to protect a signal line from ESD.; PROD_ID: DIO-15359
D6 = SparkFun-DiscreteSemi:DIODE-SCHOTTKY: Schottky diode A Schottky diode is a semiconductor diode which has a low forward voltage drop and a very fast switching action.; PROD_ID: DIO-10955
D8 D18 = SparkFun-LED:LED-GREEN: Green SMD LED Used in manufacturing of various products at SparkFun Packages: 0603 - SMD 0603 package [Product Link] <http://www.futureelectronics.com/en/technologies/semiconductors/optoelectronics/leds/Pages/9894312-LTST-C190GKT.aspx?CrossPart=HSMG-C190&IM=0> LilyPad 1206 - SMD1206 LilyPad package [Product Link] <http://www.futureelectronics.com/en/Technologies/Product.aspx?ProductID=IN150NGHARVATEKCORPORATION2049943&IM=0> 1206 - SMD1206 package [Product Link] <http://www.futureelectronics.com/en/technologies/semiconductors/optoelectronics/leds/Pages/8315665-LTST-C150KGKT.aspx?IM=0> 1206 Bottom Mount -SMD 1206 Bottom Mount [Product Link] <http://www.digikey.com/product-detail/en/lite-on-inc/LTST-C230KGKT/160-1456-1-ND/386854> SparkFun Products: Pro Mini 328 -5V <https://www.sparkfun.com/products/821> RedBoard <https://www.sparkfun.com/products/12757> MP3 Trigger <https://www.sparkfun.com/products/13720> Makey Makey <https://www.sparkfun.com/products/11076>; PROD_ID: DIO-00821
D10 D15 = SparkFun-DiscreteSemi:DIODE-SCHOTTKY: Schottky diode A Schottky diode is a semiconductor diode which has a low forward voltage drop and a very fast switching action.; PROD_ID: DIO-15217
D11 = SparkFun-DiscreteSemi:DIODE-ZENER: Zener Diode A Zener diode allows current to flow from its anode to its cathode like a normal semiconductor diode, but it also permits current to flow in the reverse direction when its "Zener voltage" is reached. - WIkipedia; PROD_ID: DIO-11284
D16 = ublox:TVS_DIODE_ARRAY_4; PROD_ID: DIO-14095
E1-E3 = SparkFun-RF:ANTENNA-SMA-GROUNDED: SMA Antenna Connector w/ Ground Edge-mount and SMD SMA connectors for RF Antennas. **4-LAYER BOARD WARNING!!** When designing a 4-layer board using any of the SMD variants, you will need to manually add a cutout polygon on any internal power layers to make sure that you don't end up with exposed copper around the edge of the routed hole for these connectors. Exposed power copper could then short to the connector body - and that would be bad. Why hasn't anyone added the cutout polygons directly to the connector footprint? Well, your internal layers (usually 2 and 15) may be covered with GND polygons and you might well want the copper to go all the way to the edge, especially under the connector SIGNAL pin. So adding cutouts to the footprint might make matters worse, not better...; PROD_ID: CONN-08289
F1 = SparkFun-Fuses:PPTC: Resettable Fuse PPTC Resettable Fuse. Really a sort of resistor with a polymeric positive temperature coefficient whose resistance increases dramatically with an increase in temperature. When heated by the power passing through the resistance rises causing the current to be limited, protecting the circuit. This is achieved by the transition of the polymer from a crystalline to an amorphous state where the conductive carbon separates breaking the conductive pathways found in the cool crystalline structure. When a PPTC cools back down it resumes conducting letting the circuit turn back on. SparkFun Products: SparkFun RedBoard - Programmed with Arduino <https://www.sparkfun.com/products/12757> Pro Micro - 5V/16MHz <https://www.sparkfun.com/products/12640> Arduino Pro 328 - 5V/16MHz <https://www.sparkfun.com/products/10915> MP3 Trigger <https://www.sparkfun.com/products/13720>; PROD_ID: RES-14313
FB1 = SparkFun-Coils:FERRITE_BEAD: Ferrite Bead (blocks, cores, rings, chokes, etc.) Inductor with layers of ferrite used to suppress high frequencies. Often used to isolate high frequency noise. SparkFun Products: IOIO-OTG - V2.2 <https://www.sparkfun.com/products/13613> SparkFun SAMD21 Mini Breakout <https://www.sparkfun.com/products/13664> SparkFun 6 Degrees of Freedom Breakout - LSM6DS3 <https://www.sparkfun.com/products/13339> SparkFun SAMD21 Dev Breakout <https://www.sparkfun.com/products/13672>; PROD_ID: NDUC-15072
FD1-FD4 = SparkFun-Aesthetics:FIDUCIAL: Fiducial Alignment Points Point-of-reference for pick-and-place machines and other optical instruments.
FRAME1-FRAME3 = SparkFun-Aesthetics:FRAME-LEDGER: Schematic Frame - Ledger Standard 11x14 US Ledger frame
H1-H4 = SparkFun-Hardware:STAND-OFF: Stand Off Drill holes for mechanically mounting via screws, standoffs, etc. Note: Use the keepout ring to avoid running the screw head into surrounding components. Variant Overviews STAND-OFF - Mechanical footprint for a #4 phillips button head screw. STAND-OFF-TIGHT - Mechanical footprint for a #4 phillips button head screw, Example SparkFun Products Screw - Phillips Head (1/4", 4-40, 10 pack) <https://www.sparkfun.com/products/10453> (PRT-10453) Screw - Phillips Head (1/2", 4-40, 10 pack) <https://www.sparkfun.com/products/10452> (PRT-10452) Screw - Phillips Head (3/4", 4-40, 10 pack) <https://www.sparkfun.com/products/10451> (PRT-10451) Screw - Phillips Head (1", 4-40, 10 pack) <https://www.sparkfun.com/products/10450> (PRT-10450)
IC1 = HPG_Solution:FE1.1S; PROD_ID: IC-16659
IC2 IC3 = New_Parts:SN74AVC4T774PW: Texas Instruments,SN74AVC4T774PW,IC, Texas Instruments SN74AVC4T774PW, Dual, Bus Transceiver, 4-Bit Non-Inverting 3-State, 1.2 3.6 V, 16-Pin TSSOP Source: Datasheet <http://www.ti.com/lit/ds/symlink/sn74avc4t774.pdf>; ARROW_PART_NUMBER: SN74AVC4T774PW; ARROW_PRICE-STOCK: https://www.arrow.com/en/products/sn74avc4t774pw/texas-instruments; DESCRIPTION: Texas Instruments,SN74AVC4T774PW,IC, Texas Instruments SN74AVC4T774PW, Dual, Bus Transceiver, 4-Bit Non-Inverting 3-State, 1.2 3.6 V, 16-Pin TSSOP; MANUFACTURER_NAME: Texas Instruments; MANUFACTURER_PART_NUMBER: SN74AVC4T774PW; MOUSER_PART_NUMBER: 595-SN74AVC4T774PW; MOUSER_PRICE-STOCK: https://www.mouser.co.uk/ProductDetail/Texas-Instruments/SN74AVC4T774PW?qs=WxL8HmPi5r44hV1AE7gRvg%3D%3D; PROD_ID: IC-15360
J1 = SparkFun-Connectors:USB_C: USB Type C 16Pin Connector Super Speed pins not available on the 16-pin purely SMD connector so this part is best for USB 2.0 implementations. D1 and D2 are tied together enabling D+/- no matter which way the cable is plugged into the connector. The two channel configuration pins (CC1/2) are exposed. These are normally connected to ground via 5.1k resistors but can be reconfigured for high current/high power applications. **4-LAYER BOARD WARNING!!** If designing 4-layer board, make sure to select the variant _4-LAYER-ISOLATED. The linked footprint (USB-C-16-4LAYER-ISOLATED) includes some very necessary cutout polygons in the inner layers (2 and 15). This prevents the PTH mounting shield legs on the USB connector from electrically connecting any other polygons on the inner layers (usually VCC and GND).; PROD_ID: CONN-14122
J2 J5 = SparkFun-Connectors:CONN_12: Multi connection point. Often used as Generic Header-pin footprint for 0.1 inch spaced/style header connections On any of the 0.1 inch spaced packages, you can populate with these: Break Away Headers - Straight <https://www.sparkfun.com/products/116> (PRT-00116) Break Away Male Headers - Right Angle <https://www.sparkfun.com/products/553> (PRT-00553) Female Headers <https://www.sparkfun.com/products/115> (PRT-00115) Break Away Headers - Machine Pin <https://www.sparkfun.com/products/117> (PRT-00117) Break Away Female Headers - Swiss Machine Pin <https://www.sparkfun.com/products/743> (PRT-00743) For SCREWTERMINALS and SPRING TERMINALS visit here: Screw Terimnals on SparkFun.com <https://www.sparkfun.com/search/results?term=Screw+Terminals> (5mm/3.5mm/2.54mm spacing) This device is also useful as a general connection point to wire up your design to another part of your project. Our various solder wires solder well into these plated through hole pads. Hook-Up Wire - Assortment (Stranded, 22 AWG) <https://www.sparkfun.com/products/11375> (PRT-11375) Hook-Up Wire - Assortment (Solid Core, 22 AWG) <https://www.sparkfun.com/products/11367> (PRT-11367) View the entire wire category on our website here <https://www.sparkfun.com/categories/141> Special notes: Molex polarized connector foot print use with SKU : PRT-08231 with associated crimp pins and housings. 1MM SMD Version SKU: PRT-10208 NOTES ON THE VARIANTS LOCK and LOCK_LONGPADS... This footprint was designed to help hold the alignment of a through-hole component (i.e. 6-pin header) while soldering it into place. You may notice that each hole has been shifted either up or down by 0.005 of an inch from it's more standard position (which is a perfectly straight line). This slight alteration caused the pins (the squares in the middle) to touch the edges of the holes. Because they are alternating, it causes a "brace" to hold the component in place. 0.005 has proven to be the perfect amount of "off-center" position when using our standard breakaway headers. Although looks a little odd when you look at the bare footprint, once you have a header in there, the alteration is very hard to notice. Also,if you push a header all the way into place, it is covered up entirely on the bottom side.
J3 = SparkFun-Connectors:MICRO-SD: microSD Socket for Transflash Various sockets for µSD. tDoc lines correctly indicate media card edge positions when inserting (unlocked, locked, depressed). NOTE: CD1 and CD2 are connected internally, and the default detect state of the socket is detect pin to ground. SparkFun Products: WAV Trigger <https://www.sparkfun.com/products/13660> CAN-Bus Shield <https://www.sparkfun.com/products/13262> SparkFun Level Shifing microSD Breakout <https://www.sparkfun.com/products/13743>; PROD_ID: CONN-16110
J4 = SparkFun-Connectors:CONN_03: Multi connection point. Often used as Generic Header-pin footprint for 0.1 inch spaced/style header connections On any of the 0.1 inch spaced packages, you can populate with these: Break Away Headers - Straight <https://www.sparkfun.com/products/116> (PRT-00116) Break Away Male Headers - Right Angle <https://www.sparkfun.com/products/553> (PRT-00553) Female Headers <https://www.sparkfun.com/products/115> (PRT-00115) Break Away Headers - Machine Pin <https://www.sparkfun.com/products/117> (PRT-00117) Break Away Female Headers - Swiss Machine Pin <https://www.sparkfun.com/products/743> (PRT-00743) Stackable Header - 3 Pin (Female, 0.1") <https://www.sparkfun.com/products/13875> (PRT-13875) For SCREWTERMINALS and SPRING TERMINALS visit here: Screw Terimnals on SparkFun.com <https://www.sparkfun.com/search/results?term=Screw+Terminals> (5mm/3.5mm/2.54mm spacing) This device is also useful as a general connection point to wire up your design to another part of your project. Our various solder wires solder well into these plated through hole pads. Hook-Up Wire - Assortment (Stranded, 22 AWG) <https://www.sparkfun.com/products/11375> (PRT-11375) Hook-Up Wire - Assortment (Solid Core, 22 AWG) <https://www.sparkfun.com/products/11367> (PRT-11367) View the entire wire category on our website here <https://www.sparkfun.com/categories/141> Special notes: Molex polarized connector foot print use with SKU : PRT-08232 with associated crimp pins and housings.
J6 = SparkFun-Connectors:QWIIC_CONNECTOR: SparkFun I2C Standard Qwiic Connector An SMD 1mm pitch JST connector makes it easy and quick (get it? Qwiic?) to connect I2C devices to each other. The Qwiic system <http://www.sparkfun.com/qwiic> enables fast and solderless connection between popular platforms and various sensors and actuators. We carry 200mm <https://www.sparkfun.com/products/14204>, 100mm <https://www.sparkfun.com/products/14205>, 50mm <https://www.sparkfun.com/products/14206>, and breadboard friendly <https://www.sparkfun.com/products/14207> Qwiic cables. We also offer 10 pcs strips <https://www.sparkfun.com/products/14323> the SMD connectors.; PROD_ID: CONN-13694
J7 = SparkFun-Connectors:JST_2MM_MALE: JST 2MM MALE RA CONNECTOR Two pin, compact surface mount connector. Commonly used as a battery input connection point. We really like the solid locking feeling and high current rating on these small connectors. We use these all the time as battery connectors. Mates to single-cell LiPo batteries. Here is the connector we sell at SparkFun: JST Right Angle Connector - White <https://www.sparkfun.com/products/8612> (PRT-08612) Datasheet <http://www.sparkfun.com/datasheets/Prototyping/Connectors/JST-Horizontal.pdf> It was used on these SparkFun products: SparkFun MOSFET Power Controller <https://www.sparkfun.com/products/11214> (PRT-11214) SparkFun Battery Babysitter - LiPo Battery Manager <https://www.sparkfun.com/products/13777> (PRT-13777) And many, many others that required a lipo battery connection.; PROD_ID: CONN-11443; SF_ID: PRT-08612
J8 = SparkFun-Connectors:CONN_02: Multi connection point. Often used as Generic Header-pin footprint for 0.1 inch spaced/style header connections On any of the 0.1 inch spaced packages, you can populate with these: Break Away Headers - Straight <https://www.sparkfun.com/products/116> (PRT-00116) Break Away Male Headers - Right Angle <https://www.sparkfun.com/products/553> (PRT-00553) Female Headers <https://www.sparkfun.com/products/115> (PRT-00115) Break Away Headers - Machine Pin <https://www.sparkfun.com/products/117> (PRT-00117) Break Away Female Headers - Swiss Machine Pin <https://www.sparkfun.com/products/743> (PRT-00743) For SCREWTERMINALS and SPRING TERMINALS visit here: Screw Terimnals on SparkFun.com <https://www.sparkfun.com/search/results?term=Screw+Terminals> (5mm/3.5mm/2.54mm spacing) This device is also useful as a general connection point to wire up your design to another part of your project. Our various solder wires solder well into these plated through hole pads. Hook-Up Wire - Assortment (Stranded, 22 AWG) <https://www.sparkfun.com/products/11375> (PRT-11375) Hook-Up Wire - Assortment (Solid Core, 22 AWG) <https://www.sparkfun.com/products/11367> (PRT-11367) View the entire wire category on our website here <https://www.sparkfun.com/categories/141> Special notes: Molex polarized connector foot print use with: PRT-08233 with associated crimp pins and housings. 2.54_SCREWTERM for use with PRT-10571. 3.5mm Screw Terminal footprints for PRT-08084 5mm Screw Terminal footprints for use with PRT-08432
J9 = temp_sim_det:SIMHOLDER: SIM Cellular Card Socket SMT 6 pin standard connection. SparkFun Products: SIM Socket <https://www.sparkfun.com/products/548> SparkFun Cellular Shield - MG2639 <https://www.sparkfun.com/products/13120> SparkFun SIM Card Socket Breakout <https://www.sparkfun.com/products/573>; PROD_ID: CONN-16272
J10 = SparkFun-Connectors:CONN_10: Multi connection point. Often used as Generic Header-pin footprint for 0.1 inch spaced/style header connections On any of the 0.1 inch spaced packages, you can populate with these: Break Away Headers - Straight <https://www.sparkfun.com/products/116> (PRT-00116) Break Away Male Headers - Right Angle <https://www.sparkfun.com/products/553> (PRT-00553) Female Headers <https://www.sparkfun.com/products/115> (PRT-00115) Break Away Headers - Machine Pin <https://www.sparkfun.com/products/117> (PRT-00117) Break Away Female Headers - Swiss Machine Pin <https://www.sparkfun.com/products/743> (PRT-00743) Arduino Stackable Header - 10 Pin <https://www.sparkfun.com/products/11376> (PRT-11376) For SCREWTERMINALS and SPRING TERMINALS visit here: Screw Terimnals on SparkFun.com <https://www.sparkfun.com/search/results?term=Screw+Terminals> (5mm/3.5mm/2.54mm spacing) This device is also useful as a general connection point to wire up your design to another part of your project. Our various solder wires solder well into these plated through hole pads. Hook-Up Wire - Assortment (Stranded, 22 AWG) <https://www.sparkfun.com/products/11375> (PRT-11375) Hook-Up Wire - Assortment (Solid Core, 22 AWG) <https://www.sparkfun.com/products/11367> (PRT-11367) View the entire wire category on our website here <https://www.sparkfun.com/categories/141> Special notes: Molex polarized connector foot print use with SKU : PRT-08231 with associated crimp pins and housings. 1MM SMD Version SKU: PRT-10208 NOTES ON THE VARIANTS LOCK and LOCK_LONGPADS... This footprint was designed to help hold the alignment of a through-hole component (i.e. 6-pin header) while soldering it into place. You may notice that each hole has been shifted either up or down by 0.005 of an inch from it's more standard position (which is a perfectly straight line). This slight alteration caused the pins (the squares in the middle) to touch the edges of the holes. Because they are alternating, it causes a "brace" to hold the component in place. 0.005 has proven to be the perfect amount of "off-center" position when using our standard breakaway headers. Although looks a little odd when you look at the bare footprint, once you have a header in there, the alteration is very hard to notice. Also,if you push a header all the way into place, it is covered up entirely on the bottom side.; PROD_ID: CONN-11563
JP1 JP2 JP4-JP8 = SparkFun-Jumpers:JUMPER-SMT_2_NC_TRACE: Normally closed trace jumper This jumper has a trace between two pads so it's normally closed (NC). Use a razor knife to open the connection. For best results follow the IPC guidelines for cutting traces: Cutout at least 0.063 mm (0.005 in). Remove all loose material to clean up the cut area. Seal the cut with an approved epoxy. Reapply solder to reclose the connection.
JP3 = SparkFun-Jumpers:JUMPER-SMT_3_2-NC_TRACE: Normally closed trace jumper (2 of 2 connections) This jumper has a trace between all three pads so they are normally closed (NC). Use a razor knife to open the connection(s). For best results follow the IPC guidelines for cutting traces: Cutout at least 0.063 mm (0.005 in). Remove all loose material to clean up the cut area. Seal the cut with an approved epoxy. Reapply solder to reclose the connection(s).
JP9-JP12 = SparkFun-Jumpers:JUMPER-SMT_2_NO: Normally open jumper This jumper has two pads in close proximity to each other. Apply solder to close the connection. Round pads are easier to solder for beginners, but are a lot larger. SparkFun Product that uses the round pads: SparkFun EL Sequencer <https://www.sparkfun.com/products/12781>
L1 L2 = New_Parts:INDUCTOR_DNP
Q1 = SparkFun-DiscreteSemi:TRANS_NPN_DUAL: Dual NPN Transistors in Single Package The MBT3904W1 puts two general purpose 3904 NPN transistors in a single package. Datasheet <http://www.onsemi.com/pub_link/Collateral/MBT3904DW1T1-D.PDF> SparkFun Products: SparkFun ESP32 Thing <https://www.sparkfun.com/products/13907>; PROD_ID: TRANS-13337
Q2 Q3 Q5 Q6 = SparkFun-DiscreteSemi:MOSFET-NCH: N-channel MOSFETs Voltage controlled devices that allow control of high current outputs. SparkFun Products: SparkFun OpenScale <https://www.sparkfun.com/products/13261> SparkFun Digital Sandbox <https://www.sparkfun.com/products/12651> SparkFun Monster Moto Shield <https://www.sparkfun.com/products/10182> SparkFun MOSFET Power Controller <https://www.sparkfun.com/products/11214>; PROD_ID: TRANS-11151
R1 R9 R11 R14 R32-R34 R38 R46 R49 = SparkFun-Resistors:100KOHM: 100kΩ resistor A resistor is a passive two-terminal electrical component that implements electrical resistance as a circuit element. Resistors act to reduce current flow, and, at the same time, act to lower voltage levels within circuits. - Wikipedia; PROD_ID: RES-07828
R2 R6 R10 R26-R29 R35 R39 R40 R44 R47 R48 R50 = SparkFun-Resistors:1KOHM: 1kΩ resistor A resistor is a passive two-terminal electrical component that implements electrical resistance as a circuit element. Resistors act to reduce current flow, and, at the same time, act to lower voltage levels within circuits. - Wikipedia; PROD_ID: RES-07856
R3 = SparkFun-Resistors:2.7KOHM: 2.7kΩ resistor A resistor is a passive two-terminal electrical component that implements electrical resistance as a circuit element. Resistors act to reduce current flow, and, at the same time, act to lower voltage levels within circuits. - Wikipedia; PROD_ID: RES-16714
R4 = SparkFun-Resistors:47KOHM: 47kΩ resistor A resistor is a passive two-terminal electrical component that implements electrical resistance as a circuit element. Resistors act to reduce current flow, and, at the same time, act to lower voltage levels within circuits. - Wikipedia; PROD_ID: RES-07871
R5 R7 = SparkFun-Resistors:5.1KOHM; PROD_ID: RES-12083
R8 = SparkFun-Resistors:4.7KOHM: 4.7kΩ resistor A resistor is a passive two-terminal electrical component that implements electrical resistance as a circuit element. Resistors act to reduce current flow, and, at the same time, act to lower voltage levels within circuits. - Wikipedia; PROD_ID: RES-07857
R12 R30 = SparkFun-Resistors:22KOHM: 22kΩ resistor A resistor is a passive two-terminal electrical component that implements electrical resistance as a circuit element. Resistors act to reduce current flow, and, at the same time, act to lower voltage levels within circuits. - Wikipedia; PROD_ID: RES-07853
R13 R31 = SparkFun-Resistors:33KOHM: 33kΩ resistor A resistor is a passive two-terminal electrical component that implements electrical resistance as a circuit element. Resistors act to reduce current flow, and, at the same time, act to lower voltage levels within circuits. - Wikipedia; PROD_ID: RES-08416
R15 R18 R19 R37 = SparkFun-Resistors:2.2KOHM: 2.2kΩ resistor A resistor is a passive two-terminal electrical component that implements electrical resistance as a circuit element. Resistors act to reduce current flow, and, at the same time, act to lower voltage levels within circuits. - Wikipedia; PROD_ID: RES-08272
R16 R17 = SparkFun-Resistors:10KOHM: 10kΩ resistor A resistor is a passive two-terminal electrical component that implements electrical resistance as a circuit element. Resistors act to reduce current flow, and, at the same time, act to lower voltage levels within circuits. - Wikipedia; PROD_ID: RES-00824
R20-R23 = SparkFun-Resistors:27OHM: 27Ω resistor A resistor is a passive two-terminal electrical component that implements electrical resistance as a circuit element. Resistors act to reduce current flow, and, at the same time, act to lower voltage levels within circuits. - Wikipedia; PROD_ID: RES-09334
R24 = SparkFun-Resistors:10OHM: 10Ω resistor A resistor is a passive two-terminal electrical component that implements electrical resistance as a circuit element. Resistors act to reduce current flow, and, at the same time, act to lower voltage levels within circuits. - Wikipedia; PROD_ID: RES-16072
R25 R45 = SparkFun-Resistors:100OHM: 100Ω resistor A resistor is a passive two-terminal electrical component that implements electrical resistance as a circuit element. Resistors act to reduce current flow, and, at the same time, act to lower voltage levels within circuits. - Wikipedia; PROD_ID: RES-07863
R36 = SparkFun-Resistors:200KOHM: 200kΩ resistor A resistor is a passive two-terminal electrical component that implements electrical resistance as a circuit element. Resistors act to reduce current flow, and, at the same time, act to lower voltage levels within circuits. - Wikipedia; PROD_ID: RES-09385
R41 = SparkFun-Resistors:220OHM: 220Ω resistor A resistor is a passive two-terminal electrical component that implements electrical resistance as a circuit element. Resistors act to reduce current flow, and, at the same time, act to lower voltage levels within circuits. - Wikipedia; PROD_ID: RES-07861
S1-S3 = SparkFun-Switches:MOMENTARY-SWITCH-SPST: Momentary Switch (Pushbutton) - SPST Normally-open (NO) SPST momentary switches (buttons, pushbuttons). Variants PTH-12MM - 12mm square, through-hole Momentary Pushbutton Switch - 12mm Square <https://www.sparkfun.com/products/9190> (COM-09190) PTH-6.0MM, PTH-6.0MM-KIT - 6.0mm square, through-hole Mini Pushbutton Switch <https://www.sparkfun.com/products/97> (COM-00097) KIT package intended for soldering kit's - only one side of pads' copper is exposed. PTH-RIGHT-ANGLE-KIT - Right-angle, through-hole Right Angle Tactile Button <https://www.sparkfun.com/products/10791> - Used on SparkFun BigTime Watch Kit <https://www.sparkfun.com/products/11734> SMD-12MM - 12mm square, surface-mount Tactile Button - SMD (12mm) <https://www.sparkfun.com/products/12993> (COM-12993) Used on SparkFun PicoBoard <https://www.sparkfun.com/products/11888> SMD-4.5MM - 4.5mm Square Trackball Switch Used on SparkFun Blackberry Trackballer Breakout <https://www.sparkfun.com/products/13169> SMD-4.6MMX2.8MM - 4.60mm x 2.80mm, surface mount Used on SparkFun Pro Micro - RP2040 <https://www.sparkfun.com/products/17717> SMD-5.2MM, SMD-5.2-REDUNDANT - 5.2mm square, surface-mount Mini Pushbutton Switch - SMD <https://www.sparkfun.com/products/8720> (COM-08720) Used on Arduino Pro Mini <https://www.sparkfun.com/products/11114> REDUNDANT package connects both switch circuits together SMD-6.0X3.5MM - 6.0 x 3.5mm, surface mount Momentary Reset Switch SMD <https://www.sparkfun.com/products/8229> (COM-08229) SMD-6.2MM-TALL - 6.2mm square, surface mount Tactile Button - SMD (6mm) <https://www.sparkfun.com/products/12992> Used on SparkFun Digital Sandbox <https://www.sparkfun.com/products/12651> SMD-RIGHT-ANGLE - Right-angle, surface mount Used on SparkFun Block for Intel® Edison - Arduino <https://www.sparkfun.com/products/13036>; PROD_ID: SWCH-14139
U1 = HPG_Solution:NINA-W106: u-blox NINA-W106 ESP32 WiFi/BLE module; PROD_ID: IC-16657
U2 = SparkFun-IC-Comms:CP2102N; PROD_ID: IC-14020
U3 = SparkFun-GPS:U-BLOX_NEO-D9S: u-blox NEO-D9S The NEO-D9S can receive the data stream of a GNSS correction service, broadcast via satellite L band and compliant to the specification the product is designed for. Integrated with a high precision GNSS receiver, such as from the u-blox F9 platform, it enables the positioning system to reach down to centimeter-level accuracy.; PROD_ID: IC-16579
U4 = SparkFun-GPS:U-BLOX_ZED_F9R: u-blox ZED-F9K ADR GPS Unit with Real Time Kinematics (RTK) and internal IMU = Automotive Dead Reckoning; PROD_ID: IC-14716
U5 = SparkFun-RF:POWER-DIVIDER: The PD0922J5050S2HF is a low profile, sub-miniature Wilkinson power divider in an easy to use surface mount package. The PD0922J5050S2HF is matched to 50 Ω and has a height profile of 0.5 mm which is ideal for high level integrations in the following markets: DVB-S, DVB-H (USA), GSM, DCS, PCS, CDMA, 3G and GPS. The PD0922J5050S2HF does not include the resistive element and therefore, requires an external resistor for operation.; DIGI-KEY_PART_NUMBER_1: 1173-1094-2-ND; MANUFACTURER_PART_NUMBER: PD0922J5050S2HF; PROD_ID: IC-16658
U6 = HPG_Solution:LARA-R6001; PROD_ID: IC-16661
U7 U8 = SparkFun-IC-Power:AP7361C-33FGE: AP7361C 3.3V LDO Regulator; PROD_ID: VREG-14094
U9 = SparkFun-IC-Comms:PCA9306: Bidirectional I2C level shifter Not compatible with all available part number pinout schemes- DOUBLE CHECK!!! Variants PCA9306DC and PSOP-8 are EOL. If your part has VREF as pin 1 then this is your variant. VSSOP_8PIN is not EOL. Datasheet <https://cdn.sparkfun.com/datasheets/BreakoutBoards/PCA9306DC.pdf> SparkFun Products SparkFun Inventor's Kit for RedBot <https://www.sparkfun.com/products/12649> (ROB-12649) SparkFun RedBot Basic Kit <https://www.sparkfun.com/products/13166> (ROB-13166) SparkFun Level Translator Breakout - PCA9306 <https://www.sparkfun.com/products/11955> (BOB-11955) SparkFun Block for Intel Edison - ADC <https://www.sparkfun.com/products/13770> (DEV-13770) SparkFun Block for Intel® Edison - Raspberry Pi B <https://www.sparkfun.com/products/13044> (DEV-13044) SparkFun RedBot Sensor - Accelerometer <https://www.sparkfun.com/products/12589> (SEN-12589); PROD_ID: IC-14450
U10 = SparkFun-IC-Power:MCP73831: MCP73831T Li-Ion, Li-Pol Controller Miniature single cell, fully integrated Li-Ion, Li-polymer charge management controller Datasheet <http://ww1.microchip.com/downloads/en/DeviceDoc/20001984g.pdf> SparkFun Products: SparkFun ESP32 Thing <https://www.sparkfun.com/products/13907> SparkFun 9DoF Razor IMU M0 <https://www.sparkfun.com/products/14001>; PROD_ID: IC-09995
U11 = SparkFun-IC-Logic:74*1G04: Single Inverter IC NOT GATE INVERTER SNGL 1IN SOT353 Supply: 1.65V to 5.5V Datasheet <http://diodes.com/datasheets/74LVC1G04.pdf> SparkFun Products SparkFun Stepoko <https://www.sparkfun.com/products/13899> (ROB-13899) SparkFun CryptoShield <https://www.sparkfun.com/products/13183> (DEV-13183) SparkFun LogicBlocks Kit <https://www.sparkfun.com/products/11006> (KIT-11006) SparkFun ArduMoto <https://www.sparkfun.com/products/9815> (DEV-09815); PROD_ID: COMP-08268
Y1 = SparkFun-Clocks:CRYSTAL-12MHZ: 12.0MHz Crystal Frequency: 12.0MHz Frequency Tolerance: ±20ppm Load Capacitance: 18pF SparkFun Products: SparkFun Logomatic <https://www.sparkfun.com/products/12772> Pocket AVR Programmer <https://www.sparkfun.com/products/9825>; PROD_ID: XTAL-08297

## Net classes
0 default: width 0.203 mm
1 power: width 0.813 mm
2 supply: width 0.406 mm
3 RF: width 0.813 mm, clearance 0.127 mm
4 DiffPair: width 0.152 mm, clearance 0.178 mm